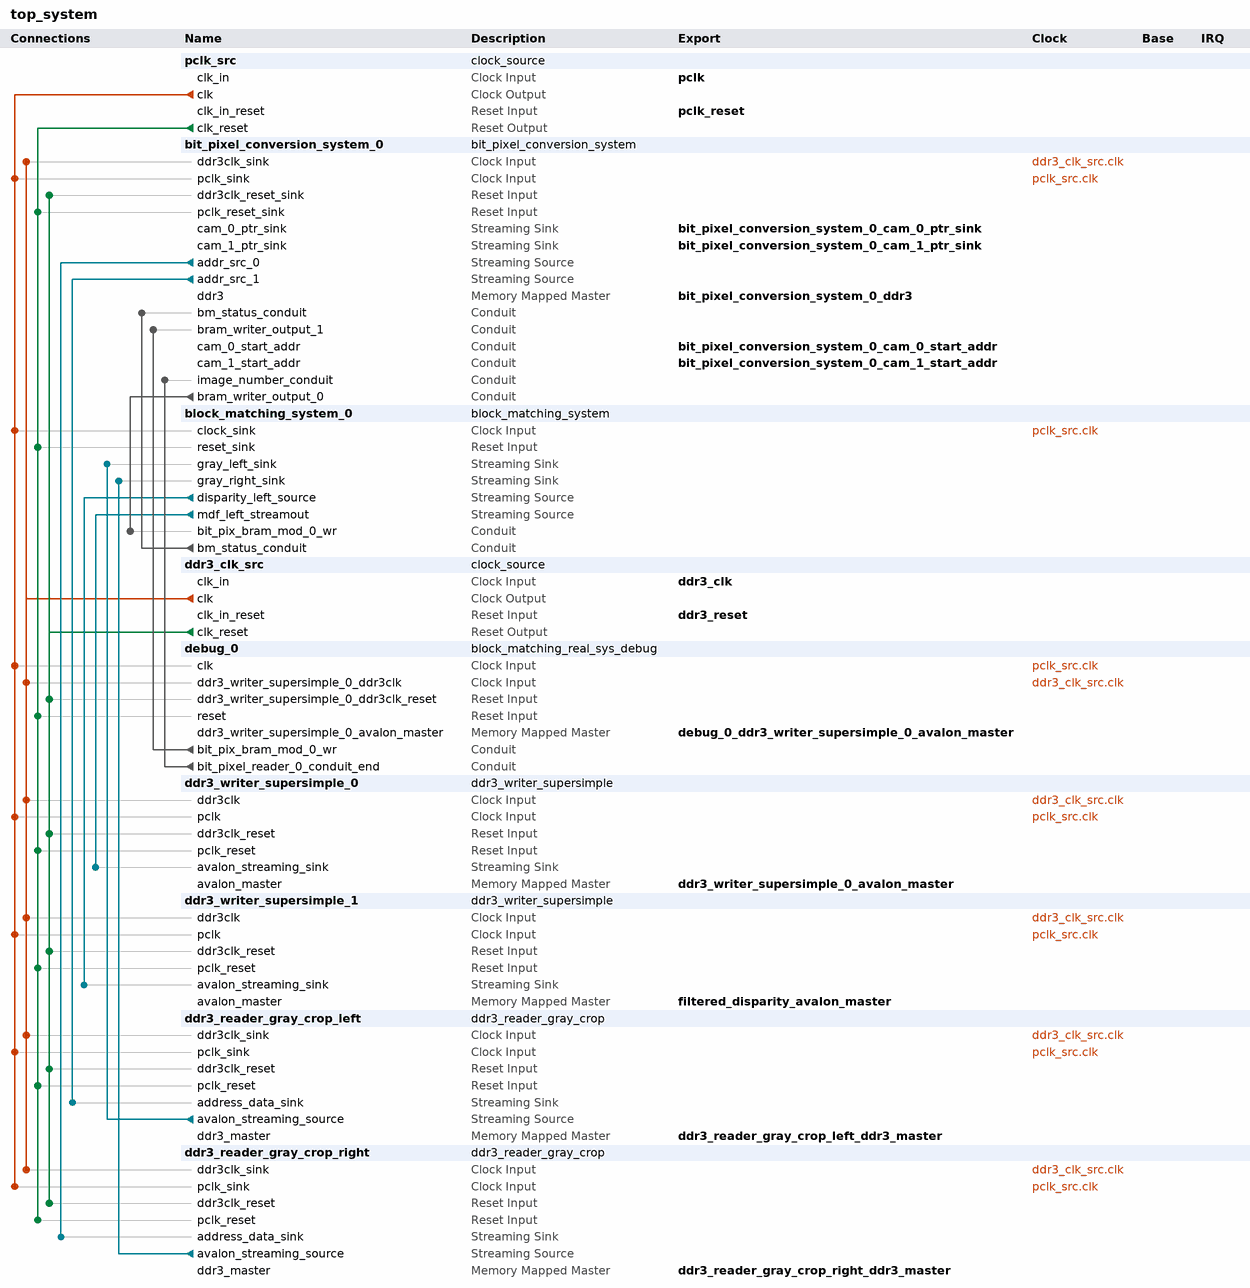
[diagram p0: system contents]
# Platform Designer (Qsys) system top_system, Cyclone V 5CSEBA6U23I7
# Parameters at their usual value, and those the tool derives, are not listed.
package require -exact qsys 18.1
create_system top_system
set_project_property DEVICE_FAMILY {Cyclone V}
set_project_property DEVICE 5CSEBA6U23I7

add_instance pclk_src clock_source 18.1
set_instance_parameter_value pclk_src clockFrequency 50000000

add_instance bit_pixel_conversion_system_0 bit_pixel_conversion_system 1.0
set_instance_parameter_value bit_pixel_conversion_system_0 center_cols 304
set_instance_parameter_value bit_pixel_conversion_system_0 third_cols 240
set_instance_parameter_value bit_pixel_conversion_system_0 third_rows 480

add_instance block_matching_system_0 block_matching_system 1.0
set_instance_parameter_value block_matching_system_0 blk_h 16
set_instance_parameter_value block_matching_system_0 blk_w 16
set_instance_parameter_value block_matching_system_0 center_w 304
set_instance_parameter_value block_matching_system_0 decimate_factor 2
set_instance_parameter_value block_matching_system_0 output_confidence 1
set_instance_parameter_value block_matching_system_0 search_blk_h 24
set_instance_parameter_value block_matching_system_0 search_blk_w 48
set_instance_parameter_value block_matching_system_0 third_h 480
set_instance_parameter_value block_matching_system_0 third_w 240

add_instance ddr3_clk_src clock_source 18.1
set_instance_parameter_value ddr3_clk_src clockFrequency 50000000

add_instance debug_0 block_matching_real_sys_debug 1.0

add_instance ddr3_writer_supersimple_0 ddr3_writer_supersimple 1.0
set_instance_parameter_value ddr3_writer_supersimple_0 burst_len 4
set_instance_parameter_value ddr3_writer_supersimple_0 in_width 16
set_instance_parameter_value ddr3_writer_supersimple_0 num_pixels 14400
set_instance_parameter_value ddr3_writer_supersimple_0 start_address 905969664

add_instance ddr3_writer_supersimple_1 ddr3_writer_supersimple 1.0
set_instance_parameter_value ddr3_writer_supersimple_1 burst_len 8
set_instance_parameter_value ddr3_writer_supersimple_1 in_width 16
set_instance_parameter_value ddr3_writer_supersimple_1 num_pixels 230400
set_instance_parameter_value ddr3_writer_supersimple_1 start_address 939524096

add_instance ddr3_reader_gray_crop_left ddr3_reader_gray_crop 1.0
set_instance_parameter_value ddr3_reader_gray_crop_left crop_width 240
set_instance_parameter_value ddr3_reader_gray_crop_left frame_lines 480
set_instance_parameter_value ddr3_reader_gray_crop_left frame_width 768
set_instance_parameter_value ddr3_reader_gray_crop_left i_am_left 1

add_instance ddr3_reader_gray_crop_right ddr3_reader_gray_crop 1.0
set_instance_parameter_value ddr3_reader_gray_crop_right crop_width 240
set_instance_parameter_value ddr3_reader_gray_crop_right frame_lines 480
set_instance_parameter_value ddr3_reader_gray_crop_right frame_width 768
set_instance_parameter_value ddr3_reader_gray_crop_right i_am_left 0

# connections
add_connection ddr3_clk_src.clk bit_pixel_conversion_system_0.ddr3clk_sink clock
add_connection ddr3_clk_src.clk ddr3_reader_gray_crop_left.ddr3clk_sink clock
add_connection ddr3_clk_src.clk ddr3_reader_gray_crop_right.ddr3clk_sink clock
add_connection ddr3_clk_src.clk ddr3_writer_supersimple_0.ddr3clk clock
add_connection ddr3_clk_src.clk ddr3_writer_supersimple_1.ddr3clk clock
add_connection ddr3_clk_src.clk debug_0.ddr3_writer_supersimple_0_ddr3clk clock
add_connection pclk_src.clk bit_pixel_conversion_system_0.pclk_sink clock
add_connection pclk_src.clk block_matching_system_0.clock_sink clock
add_connection pclk_src.clk ddr3_reader_gray_crop_left.pclk_sink clock
add_connection pclk_src.clk ddr3_reader_gray_crop_right.pclk_sink clock
add_connection pclk_src.clk ddr3_writer_supersimple_0.pclk clock
add_connection pclk_src.clk ddr3_writer_supersimple_1.pclk clock
add_connection pclk_src.clk debug_0.clk clock
add_connection ddr3_clk_src.clk_reset bit_pixel_conversion_system_0.ddr3clk_reset_sink reset
add_connection ddr3_clk_src.clk_reset ddr3_reader_gray_crop_left.ddr3clk_reset reset
add_connection ddr3_clk_src.clk_reset ddr3_reader_gray_crop_right.ddr3clk_reset reset
add_connection ddr3_clk_src.clk_reset ddr3_writer_supersimple_0.ddr3clk_reset reset
add_connection ddr3_clk_src.clk_reset ddr3_writer_supersimple_1.ddr3clk_reset reset
add_connection ddr3_clk_src.clk_reset debug_0.ddr3_writer_supersimple_0_ddr3clk_reset reset
add_connection pclk_src.clk_reset bit_pixel_conversion_system_0.pclk_reset_sink reset
add_connection pclk_src.clk_reset block_matching_system_0.reset_sink reset
add_connection pclk_src.clk_reset ddr3_reader_gray_crop_left.pclk_reset reset
add_connection pclk_src.clk_reset ddr3_reader_gray_crop_right.pclk_reset reset
add_connection pclk_src.clk_reset ddr3_writer_supersimple_0.pclk_reset reset
add_connection pclk_src.clk_reset ddr3_writer_supersimple_1.pclk_reset reset
add_connection pclk_src.clk_reset debug_0.reset reset
add_connection bit_pixel_conversion_system_0.addr_src_0 ddr3_reader_gray_crop_right.address_data_sink avalon_streaming
add_connection bit_pixel_conversion_system_0.addr_src_1 ddr3_reader_gray_crop_left.address_data_sink avalon_streaming
add_connection block_matching_system_0.disparity_left_source ddr3_writer_supersimple_1.avalon_streaming_sink avalon_streaming
add_connection block_matching_system_0.mdf_left_streamout ddr3_writer_supersimple_0.avalon_streaming_sink avalon_streaming
add_connection ddr3_reader_gray_crop_left.avalon_streaming_source block_matching_system_0.gray_left_sink avalon_streaming
add_connection ddr3_reader_gray_crop_right.avalon_streaming_source block_matching_system_0.gray_right_sink avalon_streaming
add_connection bit_pixel_conversion_system_0.bram_writer_output_0 block_matching_system_0.bit_pix_bram_mod_0_wr conduit
add_connection block_matching_system_0.bm_status_conduit bit_pixel_conversion_system_0.bm_status_conduit conduit
add_connection debug_0.bit_pix_bram_mod_0_wr bit_pixel_conversion_system_0.bram_writer_output_1 conduit
add_connection debug_0.bit_pixel_reader_0_conduit_end bit_pixel_conversion_system_0.image_number_conduit conduit

# exported interfaces
add_interface bit_pixel_conversion_system_0_cam_0_ptr_sink avalon_streaming sink
set_interface_property bit_pixel_conversion_system_0_cam_0_ptr_sink EXPORT_OF bit_pixel_conversion_system_0.cam_0_ptr_sink
add_interface bit_pixel_conversion_system_0_cam_0_start_addr conduit end
set_interface_property bit_pixel_conversion_system_0_cam_0_start_addr EXPORT_OF bit_pixel_conversion_system_0.cam_0_start_addr
add_interface bit_pixel_conversion_system_0_cam_1_ptr_sink avalon_streaming sink
set_interface_property bit_pixel_conversion_system_0_cam_1_ptr_sink EXPORT_OF bit_pixel_conversion_system_0.cam_1_ptr_sink
add_interface bit_pixel_conversion_system_0_cam_1_start_addr conduit end
set_interface_property bit_pixel_conversion_system_0_cam_1_start_addr EXPORT_OF bit_pixel_conversion_system_0.cam_1_start_addr
add_interface bit_pixel_conversion_system_0_ddr3 avalon master
set_interface_property bit_pixel_conversion_system_0_ddr3 EXPORT_OF bit_pixel_conversion_system_0.ddr3
add_interface ddr3_clk clock sink
set_interface_property ddr3_clk EXPORT_OF ddr3_clk_src.clk_in
add_interface ddr3_reader_gray_crop_left_ddr3_master avalon master
set_interface_property ddr3_reader_gray_crop_left_ddr3_master EXPORT_OF ddr3_reader_gray_crop_left.ddr3_master
add_interface ddr3_reader_gray_crop_right_ddr3_master avalon master
set_interface_property ddr3_reader_gray_crop_right_ddr3_master EXPORT_OF ddr3_reader_gray_crop_right.ddr3_master
add_interface ddr3_reset reset sink
set_interface_property ddr3_reset EXPORT_OF ddr3_clk_src.clk_in_reset
add_interface ddr3_writer_supersimple_0_avalon_master avalon master
set_interface_property ddr3_writer_supersimple_0_avalon_master EXPORT_OF ddr3_writer_supersimple_0.avalon_master
add_interface debug_0_ddr3_writer_supersimple_0_avalon_master avalon master
set_interface_property debug_0_ddr3_writer_supersimple_0_avalon_master EXPORT_OF debug_0.ddr3_writer_supersimple_0_avalon_master
add_interface filtered_disparity_avalon_master avalon master
set_interface_property filtered_disparity_avalon_master EXPORT_OF ddr3_writer_supersimple_1.avalon_master
add_interface pclk clock sink
set_interface_property pclk EXPORT_OF pclk_src.clk_in
add_interface pclk_reset reset sink
set_interface_property pclk_reset EXPORT_OF pclk_src.clk_in_reset

set_interconnect_requirement {$system} qsys_mm.clockCrossingAdapter HANDSHAKE
set_interconnect_requirement {$system} qsys_mm.enableEccProtection FALSE
set_interconnect_requirement {$system} qsys_mm.insertDefaultSlave FALSE
set_interconnect_requirement {$system} qsys_mm.maxAdditionalLatency 1

save_system top_system.qsys
